# Altium project Relay_Mux.PrjPCB
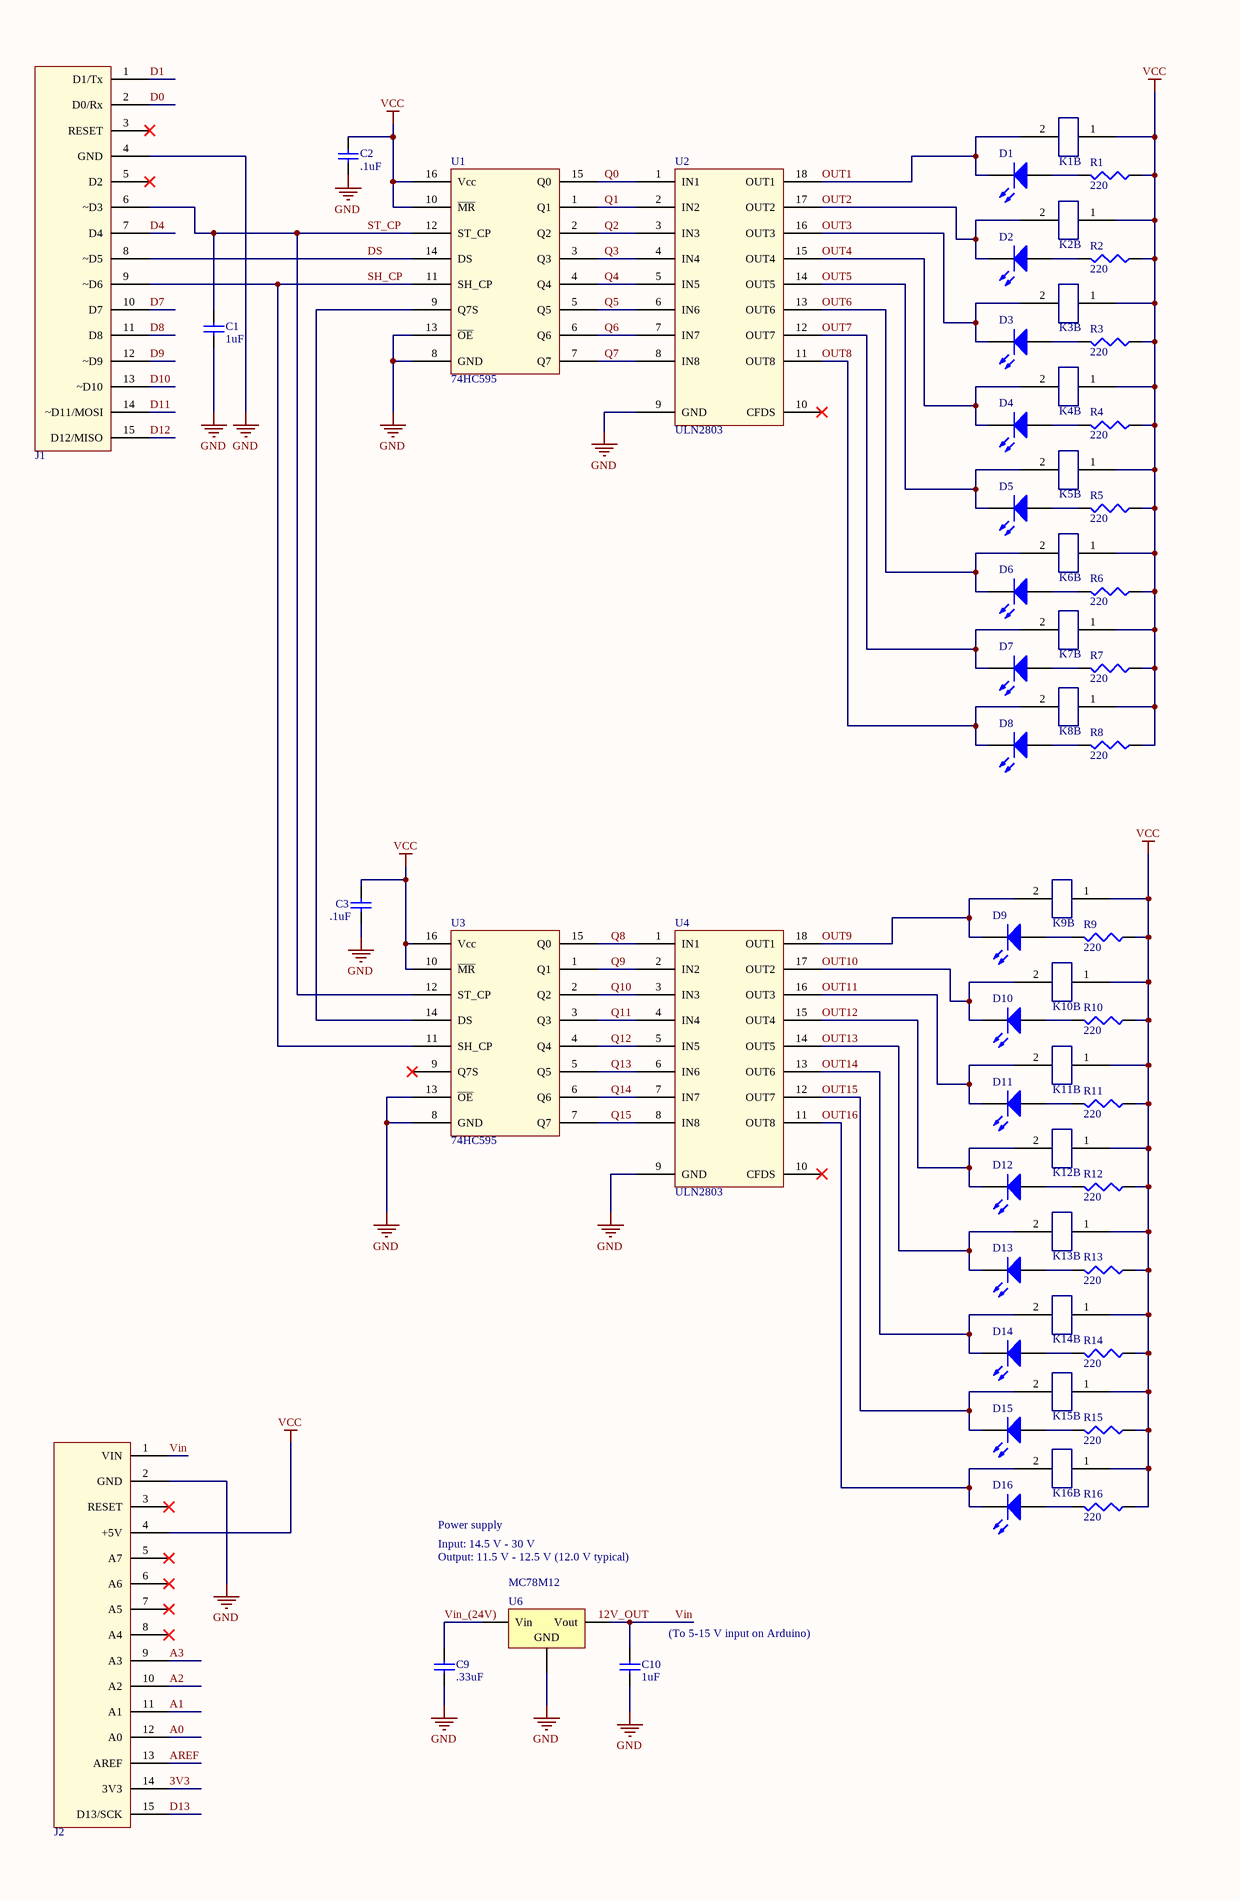
[diagram p0: Relay_Mux_Sheet1.SchDoc, left]
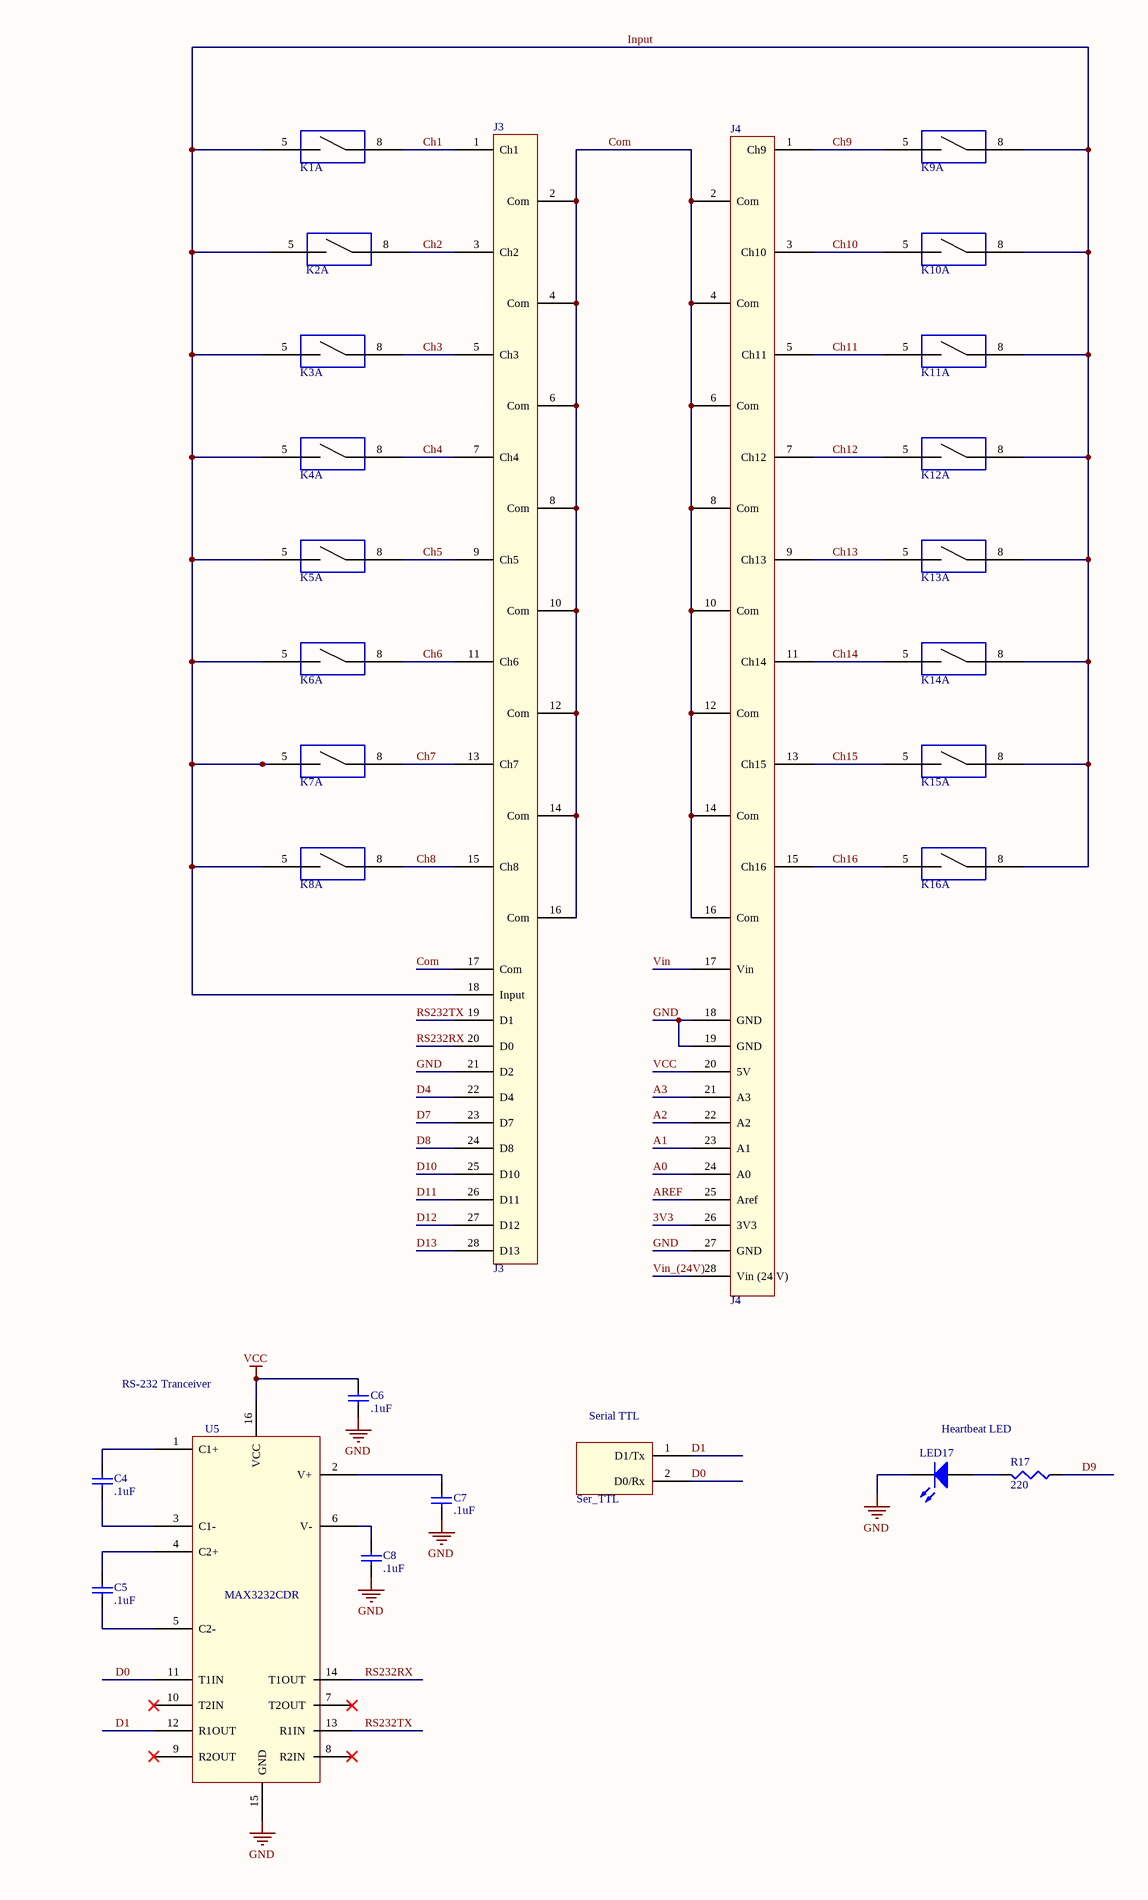
[diagram p1: Relay_Mux_Sheet1.SchDoc, right]
1 sheet, 71 parts. Net scope: global (net labels, ports and power ports of the same name join across sheets).
Board files: Relay_Mux.PcbDoc, OSHW-logo.PcbDoc

## Sheet Relay_Mux_Sheet1.SchDoc
size C

### Parts
C1  value 1uF  [0603_Capacitor]  (hidden comment: Cap)
C2  value .1uF  [0603_Capacitor]  (hidden comment: Cap)
C3  value .1uF  [0603_Capacitor]  (hidden comment: Cap)
C4  value .1uF  [0603_Capacitor]  (hidden comment: Cap)
C5  value .1uF  [0603_Capacitor]  (hidden comment: Cap)
C6  value .1uF  [0603_Capacitor]  (hidden comment: Cap)
C7  value .1uF  [0603_Capacitor]  (hidden comment: Cap)
C8  value .1uF  [0603_Capacitor]  (hidden comment: Cap)
C9  value .33uF  [0603_Capacitor]  (hidden comment: Cap)
C10  value 1uF  [0805_cap_CAPC3013X10N]  (hidden comment: Cap)
D1  LED3  [LITE_ON_LED]  (value not drawn)
D2  LED3  [LITE_ON_LED]  (value not drawn)
D3  LED3  [LITE_ON_LED]  (value not drawn)
D4  LED3  [LITE_ON_LED]  (value not drawn)
D5  LED3  [LITE_ON_LED]  (value not drawn)
D6  LED3  [LITE_ON_LED]  (value not drawn)
D7  LED3  [LITE_ON_LED]  (value not drawn)
D8  LED3  [LITE_ON_LED]  (value not drawn)
D9  LED3  [LITE_ON_LED]  (value not drawn)
D10  LED3  [LITE_ON_LED]  (value not drawn)
D11  LED11  [LITE_ON_LED]  (value not drawn)
D12  LED3  [LITE_ON_LED]  (value not drawn)
D13  LED3  [LITE_ON_LED]  (value not drawn)
D14  LED3  [LITE_ON_LED]  (value not drawn)
D15  LED3  [LITE_ON_LED]  (value not drawn)
D16  LED3  [LITE_ON_LED]  (value not drawn)
J1  J1_Nano  [J1, J2 - Arduino Nano]  (value not drawn)
J2  J2_Nano  [J1, J2 - Arduino Nano]  (value not drawn)
J3  J3  [Term_Block_Amphenol_20020327]
J4  J4  [Term_Block_Amphenol_20020327]
K1  K*  [Relay_G6DN-1A DC5]  (value not drawn)  (parts A,B of 2)
K2  K*  [Relay_G6DN-1A DC5]  (value not drawn)  (parts A,B of 2)
K3  K*  [Relay_G6DN-1A DC5]  (value not drawn)  (parts A,B of 2)
K4  K*  [Relay_G6DN-1A DC5]  (value not drawn)  (parts A,B of 2)
K5  K*  [Relay_G6DN-1A DC5]  (value not drawn)  (parts A,B of 2)
K6  K*  [Relay_G6DN-1A DC5]  (value not drawn)  (parts A,B of 2)
K7  K*  [Relay_G6DN-1A DC5]  (value not drawn)  (parts A,B of 2)
K8  K*  [Relay_G6DN-1A DC5]  (value not drawn)  (parts A,B of 2)
K9  K*  [Relay_G6DN-1A DC5]  (value not drawn)  (parts A,B of 2)
K10  K*  [Relay_G6DN-1A DC5]  (value not drawn)  (parts A,B of 2)
K11  K*  [Relay_G6DN-1A DC5]  (value not drawn)  (parts A,B of 2)
K12  K*  [Relay_G6DN-1A DC5]  (value not drawn)  (parts A,B of 2)
K13  K*  [Relay_G6DN-1A DC5]  (value not drawn)  (parts A,B of 2)
K14  K*  [Relay_G6DN-1A DC5]  (value not drawn)  (parts A,B of 2)
K15  K*  [Relay_G6DN-1A DC5]  (value not drawn)  (parts A,B of 2)
K16  K*  [Relay_G6DN-1A DC5]  (value not drawn)  (parts A,B of 2)
LED17  LED3  [LITE_ON_LED]  (value not drawn)
R1  value 220  [0603_Resistor]  (hidden comment: Res3)
R2  value 220  [0603_Resistor]  (hidden comment: Res3)
R3  value 220  [0603_Resistor]  (hidden comment: Res3)
R4  value 220  [0603_Resistor]  (hidden comment: Res3)
R5  value 220  [0603_Resistor]  (hidden comment: Res3)
R6  value 220  [0603_Resistor]  (hidden comment: Res3)
R7  value 220  [0603_Resistor]  (hidden comment: Res3)
R8  value 220  [0603_Resistor]  (hidden comment: Res3)
R9  value 220  [0603_Resistor]  (hidden comment: Res3)
R10  value 220  [0603_Resistor]  (hidden comment: Res3)
R11  value 220  [0603_Resistor]  (hidden comment: Res3)
R12  value 220  [0603_Resistor]  (hidden comment: Res3)
R13  value 220  [0603_Resistor]  (hidden comment: Res3)
R14  value 220  [0603_Resistor]  (hidden comment: Res3)
R15  value 220  [0603_Resistor]  (hidden comment: Res3)
R16  value 220  [0603_Resistor]  (hidden comment: Res3)
R17  value 220  [0603_Resistor]  (hidden comment: Res3)
Ser_TTL  Ser_TTL  [Ser_TTL]  (value not drawn)
U1  74HC595  [16Pin_SOIC127P1030X265-16N]
U2  ULN2803  [18Pin_SOIC127P1030X265-18N]
U3  74HC595  [16Pin_SOIC127P1030X265-16N]
U4  ULN2803  [18Pin_SOIC127P1030X265-18N]
U5  MAX3232  [16 pin SOIC - MAX3232 - SOIC127P600X175-16N]  (value not drawn)
U6  MC78M12  [MC78M12 footprint - linear regulator - DPAK228P992X238-3N]

### Nets
GND: C1.1 C2.1 C3.1 C6.2 C7.2 C8.2 C9.2 C10.2 J1.4(GND) J2.2(GND) J3.21(D2) J4.18(GND) J4.19(GND) J4.27(GND) LED17.2(K) U1.8(GND) U1.13(~{OE}) U2.9(GND) U3.8(GND) U3.13(~{OE}) U4.9(GND) U5.15(GND) U6.2(GND)
VCC: C2.2 C3.2 C6.1 J2.4(+5V) J4.20(5V) K1.1 K2.1 K3.1 K4.1 K5.1 K6.1 K7.1 K8.1 K9.1 K10.1 K11.1 K12.1 K13.1 K14.1 K15.1 K16.1 R1.1 R2.1 R3.1 R4.1 R5.1 R6.1 R7.1 R8.1 R9.1 R10.1 R11.1 R12.1 R13.1 R14.1 R15.1 R16.1 U1.10(~{MR}) U1.16(Vcc) U3.10(~{MR}) U3.16(Vcc) U5.16(VCC)
3V3: J2.14(3V3) J4.26(3V3)
A0: J2.12(A0) J4.24(A0)
A1: J2.11(A1) J4.23(A1)
A2: J2.10(A2) J4.22(A2)
A3: J2.9(A3) J4.21(A3)
AREF: J2.13(AREF) J4.25(Aref)
Ch1: J3.1(Ch1) K1.8
Ch2: J3.3(Ch2) K2.8
Ch3: J3.5(Ch3) K3.8
Ch4: J3.7(Ch4) K4.8
Ch5: J3.9(Ch5) K5.8
Ch6: J3.11(Ch6) K6.8
Ch7: J3.13(Ch7) K7.8
Ch8: J3.15(Ch8) K8.8
Ch9: J4.1(Ch9) K9.5
Ch10: J4.3(Ch10) K10.5
Ch11: J4.5(Ch11) K11.5
Ch12: J4.7(Ch12) K12.5
Ch13: J4.9(Ch13) K13.5
Ch14: J4.11(Ch14) K14.5
Ch15: J4.13(Ch15) K15.5
Ch16: J4.15(Ch16) K16.5
Com: J3.2(Com) J3.4(Com) J3.6(Com) J3.8(Com) J3.10(Com) J3.12(Com) J3.14(Com) J3.16(Com) J3.17(Com) J4.2(Com) J4.4(Com) J4.6(Com) J4.8(Com) J4.10(Com) J4.12(Com) J4.14(Com) J4.16(Com)
D0: J1.2(D0/Rx) Ser_TTL.2(D0/Rx) U5.11(T1IN)
D1: J1.1(D1/Tx) Ser_TTL.1(D1/Tx) U5.12(R1OUT)
D4: J1.7(D4) J3.22(D4)
D7: J1.10(D7) J3.23(D7)
D8: J1.11(D8) J3.24(D8)
D9: J1.12(~D9) R17.1
D10: J1.13(~D10) J3.25(D10)
D11: J1.14(~D11/MOSI) J3.26(D11)
D12: J1.15(D12/MISO) J3.27(D12)
D13: J2.15(D13/SCK) J3.28(D13)
DS: J1.8(~D5) U1.14(DS)
Input: J3.18(Input) K1.5 K2.5 K3.5 K4.5 K5.5 K6.5 K7.5 K8.5 K9.8 K10.8 K11.8 K12.8 K13.8 K14.8 K15.8 K16.8
OUT1: D1.2(K) K1.2 U2.18(OUT1)
OUT2: D2.2(K) K2.2 U2.17(OUT2)
OUT3: D3.2(K) K3.2 U2.16(OUT3)
OUT4: D4.2(K) K4.2 U2.15(OUT4)
OUT5: D5.2(K) K5.2 U2.14(OUT5)
OUT6: D6.2(K) K6.2 U2.13(OUT6)
OUT7: D7.2(K) K7.2 U2.12(OUT7)
OUT8: D8.2(K) K8.2 U2.11(OUT8)
OUT9: D9.2(K) K9.2 U4.18(OUT1)
OUT10: D10.2(K) K10.2 U4.17(OUT2)
OUT11: D11.2(K) K11.2 U4.16(OUT3)
OUT12: D12.2(K) K12.2 U4.15(OUT4)
OUT13: D13.2(K) K13.2 U4.14(OUT5)
OUT14: D14.2(K) K14.2 U4.13(OUT6)
OUT15: D15.2(K) K15.2 U4.12(OUT7)
OUT16: D16.2(K) K16.2 U4.11(OUT8)
Q0: U1.15(Q0) U2.1(IN1)
Q1: U1.1(Q1) U2.2(IN2)
Q2: U1.2(Q2) U2.3(IN3)
Q3: U1.3(Q3) U2.4(IN4)
Q4: U1.4(Q4) U2.5(IN5)
Q5: U1.5(Q5) U2.6(IN6)
Q6: U1.6(Q6) U2.7(IN7)
Q7: U1.7(Q7) U2.8(IN8)
Q8: U3.15(Q0) U4.1(IN1)
Q9: U3.1(Q1) U4.2(IN2)
Q10: U3.2(Q2) U4.3(IN3)
Q11: U3.3(Q3) U4.4(IN4)
Q12: U3.4(Q4) U4.5(IN5)
Q13: U3.5(Q5) U4.6(IN6)
Q14: U3.6(Q6) U4.7(IN7)
Q15: U3.7(Q7) U4.8(IN8)
RS232RX: J3.20(D0) U5.14(T1OUT)
RS232TX: J3.19(D1) U5.13(R1IN)
SH_CP: J1.9(~D6) U1.11(SH_CP) U3.11(SH_CP)
ST_CP: C1.2 J1.6(~D3) U1.12(ST_CP) U3.12(ST_CP)
Vin: C10.1 J2.1(VIN) J4.17(Vin) U6.3(Vout)
Vin_(24V): C9.1 J4.28(Vin_(24_V)) U6.1(Vin)
NetC4_1: C4.1 U5.3(C1-)
NetC4_2: C4.2 U5.1(C1+)
NetC5_1: C5.1 U5.5(C2-)
NetC5_2: C5.2 U5.4(C2+)
NetC7_1: C7.1 U5.2(V+)
NetC8_1: C8.1 U5.6(V-)
NetD1_1: D1.1(A) R1.2
NetD2_1: D2.1(A) R2.2
NetD3_1: D3.1(A) R3.2
NetD4_1: D4.1(A) R4.2
NetD5_1: D5.1(A) R5.2
NetD6_1: D6.1(A) R6.2
NetD7_1: D7.1(A) R7.2
NetD8_1: D8.1(A) R8.2
NetD9_1: D9.1(A) R9.2
NetD10_1: D10.1(A) R10.2
NetD11_1: D11.1(A) R11.2
NetD12_1: D12.1(A) R12.2
NetD13_1: D13.1(A) R13.2
NetD14_1: D14.1(A) R14.2
NetD15_1: D15.1(A) R15.2
NetD16_1: D16.1(A) R16.2
NetLED17_1: LED17.1(A) R17.2
NetU1_9: U1.9(Q7S) U3.14(DS)

Not connected (* = marked no-connect by the designer): J1 3(RESET)* 5(D2)*; J2 3(RESET)* 5(A7)* 6(A6)* 7(A5)* 8(A4)*; U2 10(CFDS)*; U3 9(Q7S)*; U4 10(CFDS)*; U5 7(T2OUT)* 8(R2IN)* 9(R2OUT)* 10(T2IN)*

### Notes on the sheet
- (near U5) RS-232 Tranceiver
- (near Ser_TTL) Serial TTL
- Heartbeat LED
- Power supply
- Input: 14.5 V - 30 V
- Output: 11.5 V - 12.5 V (12.0 V typical)
- (near U5) MAX3232CDR
- (near C10) (To 5-15 V input on Arduino)
- Labels drawn without touching a wire or pin: 12V_OUT

### Library data of the parts
C1-C10 = Cap: Capacitor; Published: 8-Jun-2000; LatestRevisionDate: 17-Jul-2002; LatestRevisionNote: Re-released for DXP Platform.; PackageReference: RAD-0.3; Publisher: Altium Limited; PackageDescription: Radial Cap, Thru-Hole; 2 Leads; 0.3 in Pin Spacing
D1-D16 LED17 = LED3: Typical BLUE SiC LED; Published: 8-Jun-2000; LatestRevisionDate: 17-Dec-2003; LatestRevisionNote: PCB Footprint replaced.; DatasheetVersion: 16-Apr-2002; PackageVersion: 16-Apr-2002; PackageReference: 3.5X2.8X1.9; Publisher: Altium Limited; PackageDescription: SM LED; 2 C-Bend Leads; Body 3.5 x 2.8 x 1.9 mm, inc leads (LxWxH typ)
J1 = J1: J1 on Arduino Nano
J2 = J2: J2 on Arduino Nano
K1-K16 = Relay_G6DN-1A DC5: Relay, SPST, 5V
R1-R17 = Res3: Resistor; Published: 8-Jun-2000; LatestRevisionDate: 29-May-2009; LatestRevisionNote: IPC-7351 Footprint Added.; PackageReference: J1-0603; Publisher: Altium Limited; PackageDescription: Chip Resistor
U6 = Volt Reg: Voltage Regulator; Published: 24-Mar-1999; LatestRevisionDate: 29-May-2009; LatestRevisionNote: IPC-7351 Footprint Added.; PackageReference: D2PAK; Publisher: Altium Limited; PackageDescription: 3-Pin Transistor Outline Package 2.54 mm Pitch, 15.1 mm Lead Span